# Altium schematic sheet DRIBLE.SchDoc
size A4
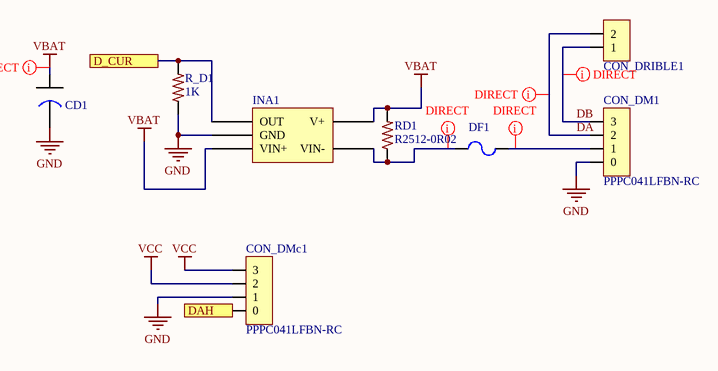
[diagram p0: DRIBLE.SchDoc]

## Parts
CD1  EEE-FK1C681GP  [EEE-FK1C681GP]  (value not drawn)
CON_DM1  PPPC041LFBN-RC  [04x01_Conector_Female - duplicate]
CON_DMc1  PPPC041LFBN-RC  [04x01_Conector_Female - duplicate]
CON_DRIBLE1  0022112022  [02x01_Conector_Male]  (value not drawn)
DF1  MF-MSMF250/16X  [RESC4632X16N]  (value not drawn)
INA1  INA169NA  [SOT95P280X125-5N]  (value not drawn)
R_D1  1K  [0402-RES-HD]
RD1  R2512-0R02  [2512-RES-HD]

## Ports
D_CUR, DAH

## Nets
GND: CD1.2 CON_DM1.0 CON_DMc1.1 INA1.2(GND) R_D1.1
VBAT: CD1.1 INA1.3(VIN+) INA1.4(V+) RD1.2
VCC: CON_DMc1.2 CON_DMc1.3
D_CUR: INA1.1(OUT) R_D1.2 ; port D_CUR
DA: CON_DM1.2 CON_DRIBLE1.2
DAH: CON_DMc1.0 ; port DAH
DB: CON_DM1.3 CON_DRIBLE1.1
NetCON_DM1_1: CON_DM1.1 DF1.1
NetDF1_2: DF1.2 INA1.5(VIN-) RD1.1

## Layout directives
net class DIRECT: DA, DB, NetCON_DM1_1, NetDF1_2, VBAT

## Library data of the parts
CD1 = CAP AL 680UF/16V: Aluminum Electrolytic Capacitors - SMD Al Lytic Cap SMT FK Series 105C
CON_DM1 CON_DMc1 = 04x01_Conector_Female-SCH: 4 Position Header Connector 0.100" (2.54mm) Through Hole Gold
CON_DRIBLE1 = 02x01_Conector_Male: CONN HEADER 2POS .100 VERT GOLD
DF1 = MF-MSMF250/16X-01.A.1: PTC RESETTABLE .30A 30V 1812
INA1 = INA169NA-01.A.1: IC CURRENT MONITOR 0.5% SOT23-5
R_D1 = R0402-1K-A.9: RES 1K OHM 1/10W 1% 0402 SMD; Part No: ERJ-2RKF1001X; Cod EMS: 05.280.029.527; Family Description: RESISTOR FILME ESPESSO 10R-1M / 1/10W / 1% / 0402. P/N: ERJ-2RKF....X – PANASONIC ELECTRONIC COMPONENTS.; Value: 1K; Family: ERJ-2RKF....X
RD1 = R2512-0R02-4: RES .02 OHM 2W 1% 2512 SMD; Part No: WSL2512R0200FEA18; Cod EMS: 05.280.029.529; Value: 0.02; Family Description: RESISTOR SENTIDO DE CORRENTE 0,010R-0,040R/ 2W / 1% / 2512 P/N: WSL2512.....FEA18 – VISHAY DALE.; Family: WSL2512.....FEA18